# Altium project ESC_Project.PrjPcb
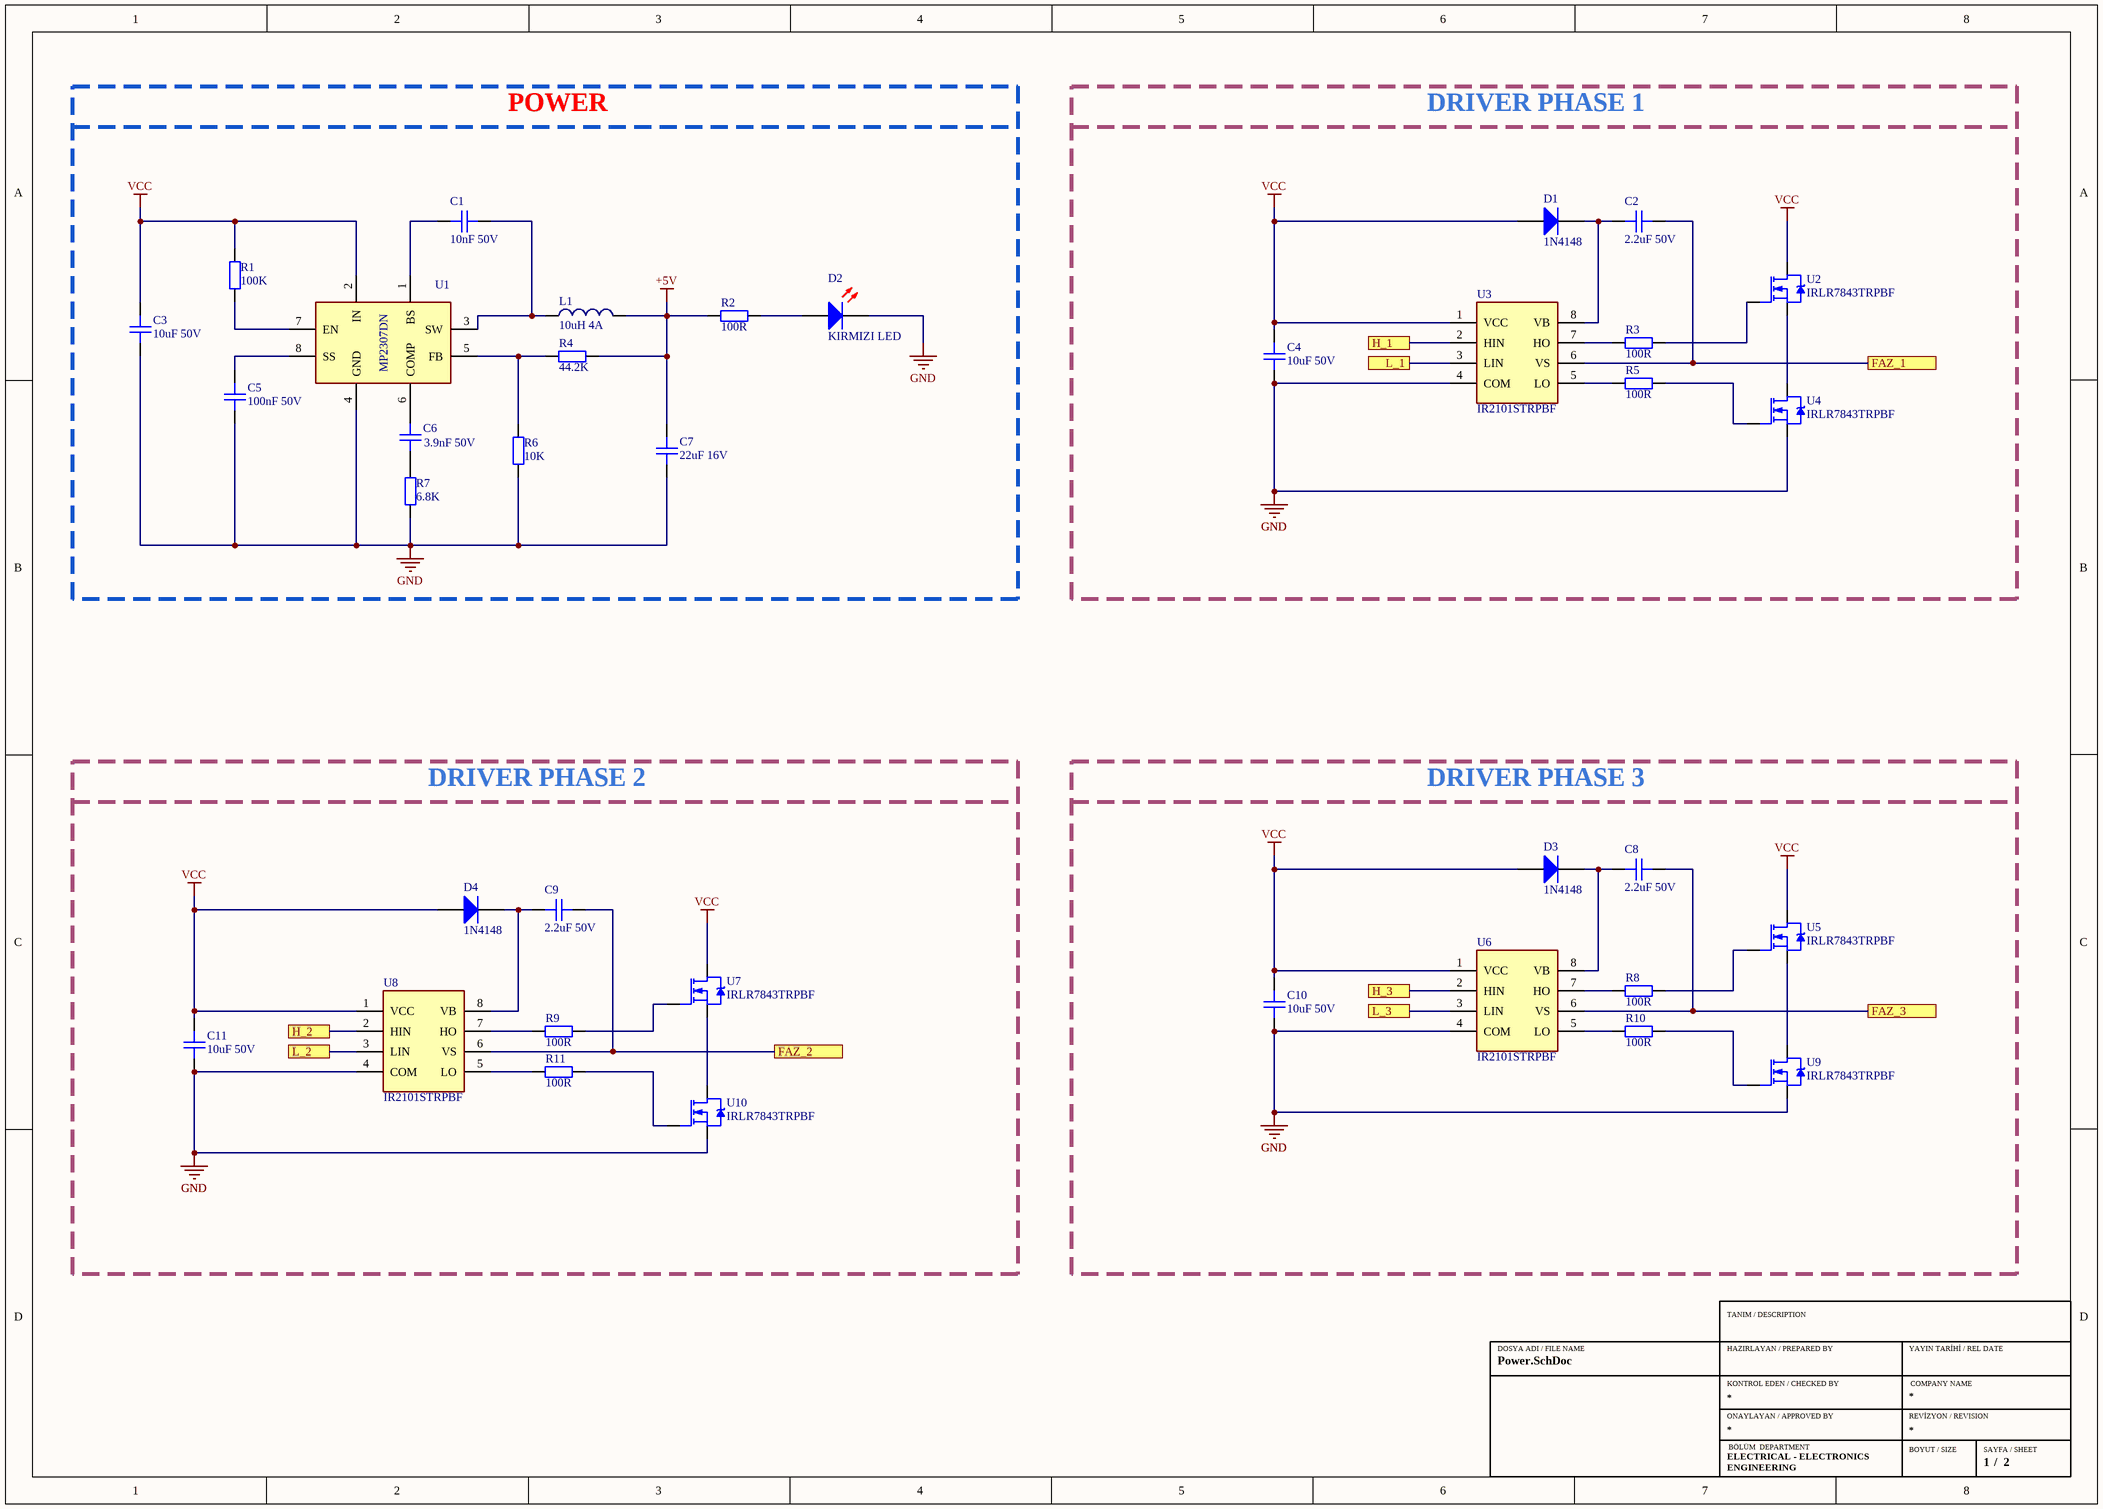
[diagram p0: Power.SchDoc]
2 sheets, 62 parts. Net scope: global (net labels, ports and power ports of the same name join across sheets).
Board file: ESC_PCB.PcbDoc
Sheets:
  Power.SchDoc
  MCU.SchDoc

## Sheet Power.SchDoc
size A3; SheetNumber: 1; SheetTotal: 2

### Parts
C1  Deger: 10nF 50V  [CAP 0805/2012]  (hidden comment: CAP CER 10000PF 50V X7R 0805)
C2  Deger: 2.2uF 50V  [CAP 1206/3216]  (hidden comment: CAP CER 2.2UF 50V X5R 1206)
C3  Deger: 10uF 50V  [CAP 1206/3216]  (hidden comment: CAP CER 10UF 50V X5R 1206)
C4  Deger: 10uF 50V  [CAP 1206/3216]  (hidden comment: CAP CER 10UF 50V X5R 1206)
C5  Deger: 100nF 50V  [CAP 0805/2012]  (hidden comment: CAP CER 0.1UF 50V X7R 0805)
C6  Deger: 3.9nF 50V  [CAP 0805/2012]  (hidden comment: CAP CER 3900PF 50V X7R 0805)
C7  Deger: 22uF 16V  [CAP 1206/3216]  (hidden comment: CAP CERAMIC 22UF 16V X7S 20% PAD)
C8  Deger: 2.2uF 50V  [CAP 1206/3216]  (hidden comment: CAP CER 2.2UF 50V X5R 1206)
C9  Deger: 2.2uF 50V  [CAP 1206/3216]  (hidden comment: CAP CER 2.2UF 50V X5R 1206)
C10  Deger: 10uF 50V  [CAP 1206/3216]  (hidden comment: CAP CER 10UF 50V X5R 1206)
C11  Deger: 10uF 50V  [CAP 1206/3216]  (hidden comment: CAP CER 10UF 50V X5R 1206)
D1  1N4148 Diyot  [SOD-123]  (value not drawn)
D2  Deger: KIRMIZI LED  [SMD: LED 0805/2012 RED]  (hidden comment: Red 645nm LED Indication - Discrete 1.8V 0805)
D3  1N4148 Diyot  [SOD-123]  (value not drawn)
D4  1N4148 Diyot  [SOD-123]  (value not drawn)
L1  FIXED IND 10UH 4A 68 MOHM SMD  [ASPI-0630LR-100M-T15]  (value not drawn)
R1  Deger: 100K  [RES_0805]  (hidden comment: RES SMD 100K OHM 1% 1/8W 0805)
R2  Deger: 100R  [RES_0805]  (hidden comment: RES SMD 100 OHM 1% 1/8W 0805)
R3  Deger: 100R  [RES_0805]  (hidden comment: RES SMD 100 OHM 1% 1/8W 0805)
R4  Deger: 44.2K  [RES_0805]  (hidden comment: RES SMD 44.2K OHM 1% 1/8W 0805)
R5  Deger: 100R  [RES_0805]  (hidden comment: RES SMD 100 OHM 1% 1/8W 0805)
R6  Deger: 10K  [RES_0805]  (hidden comment: RES SMD 10K OHM 1% 1/8W 0805)
R7  Deger: 6.8K  [RES_0805]  (hidden comment: RES SMD 6.8K OHM 1% 1/8W 0805)
R8  Deger: 100R  [RES_0805]  (hidden comment: RES SMD 100 OHM 1% 1/8W 0805)
R9  Deger: 100R  [RES_0805]  (hidden comment: RES SMD 100 OHM 1% 1/8W 0805)
R10  Deger: 100R  [RES_0805]  (hidden comment: RES SMD 100 OHM 1% 1/8W 0805)
R11  Deger: 100R  [RES_0805]  (hidden comment: RES SMD 100 OHM 1% 1/8W 0805)
U1  IC REG BUCK ADJUSTABLE 3A 8SOIC  [SOIC8_PAD]  (value not drawn)
U2  Deger: IRLR7843TRPBF  [DPAK]  (hidden comment: MOSFET N-CH 30V 161A DPAK)
U3  Deger: IR2101STRPBF  [SOIC8]  (hidden comment: IC GATE DRVR HALF-BRIDGE 8SOIC)
U4  Deger: IRLR7843TRPBF  [DPAK]  (hidden comment: MOSFET N-CH 30V 161A DPAK)
U5  Deger: IRLR7843TRPBF  [DPAK]  (hidden comment: MOSFET N-CH 30V 161A DPAK)
U6  Deger: IR2101STRPBF  [SOIC8]  (hidden comment: IC GATE DRVR HALF-BRIDGE 8SOIC)
U7  Deger: IRLR7843TRPBF  [DPAK]  (hidden comment: MOSFET N-CH 30V 161A DPAK)
U8  Deger: IR2101STRPBF  [SOIC8]  (hidden comment: IC GATE DRVR HALF-BRIDGE 8SOIC)
U9  Deger: IRLR7843TRPBF  [DPAK]  (hidden comment: MOSFET N-CH 30V 161A DPAK)
U10  Deger: IRLR7843TRPBF  [DPAK]  (hidden comment: MOSFET N-CH 30V 161A DPAK)

### Ports
FAZ_1, FAZ_2, FAZ_3, H_1, H_2, H_3, L_1, L_2, L_3

### Nets
+5V: C7.2 L1.2 R2.1 R4.2
GND: C3.1 C4.1 C5.1 C7.1 C10.1 C11.1 D2.2(K) R6.1 R7.1 U1.4(GND) U3.4(COM) U4.3(S) U6.4(COM) U8.4(COM) U9.3(S) U10.3(S)
VCC: C3.2 C4.2 C10.2 C11.2 D1.1(A) D3.1(A) D4.1(A) R1.2 U1.2(IN) U2.4(D) U3.1(VCC) U5.4(D) U6.1(VCC) U7.4(D) U8.1(VCC)
NetC1_1: C1.1 U1.1(BS)
NetC1_2: C1.2 L1.1 U1.3(SW)
NetC2_1: C2.1 D1.2(K) U3.8(VB)
NetC2_2: C2.2 U3.6(VS) ; port FAZ_1
NetC5_2: C5.2 U1.8(SS)
NetC6_1: C6.1 R7.2
NetC6_2: C6.2 U1.6(COMP)
NetC8_1: C8.1 D3.2(K) U6.8(VB)
NetC8_2: C8.2 U6.6(VS) ; port FAZ_3
NetC9_1: C9.1 D4.2(K) U8.8(VB)
NetC9_2: C9.2 U8.6(VS) ; port FAZ_2
NetD2_1: D2.1(A) R2.2
NetR1_1: R1.1 U1.7(EN)
NetR3_1: R3.1 U3.7(HO)
NetR3_2: R3.2 U2.1(G)
NetR4_1: R4.1 R6.2 U1.5(FB)
NetR5_1: R5.1 U3.5(LO)
NetR5_2: R5.2 U4.1(G)
NetR8_1: R8.1 U6.7(HO)
NetR8_2: R8.2 U5.1(G)
NetR9_1: R9.1 U8.7(HO)
NetR9_2: R9.2 U7.1(G)
NetR10_1: R10.1 U6.5(LO)
NetR10_2: R10.2 U9.1(G)
NetR11_1: R11.1 U8.5(LO)
NetR11_2: R11.2 U10.1(G)
NetU2_3: U2.3(S) U4.4(D)
NetU3_2: U3.2(HIN) ; port H_1
NetU3_3: U3.3(LIN) ; port L_1
NetU5_3: U5.3(S) U9.4(D)
NetU6_2: U6.2(HIN) ; port H_3
NetU6_3: U6.3(LIN) ; port L_3
NetU7_3: U7.3(S) U10.4(D)
NetU8_2: U8.2(HIN) ; port H_2
NetU8_3: U8.3(LIN) ; port L_2

### Notes on the sheet
- POWER
- DRIVER PHASE 1
- DRIVER PHASE 2
- DRIVER PHASE 3
- TANIM / DESCRIPTION
- DOSYA ADI / FILE NAME
- HAZIRLAYAN / PREPARED BY
- KONTROL EDEN / CHECKED BY
- YAYIN TARİHİ / REL DATE
- COMPANY NAME
- ONAYLAYAN / APPROVED BY
- ELECTRICAL - ELECTRONICS
- BÖLÜM  DEPARTMENT
- BOYUT / SIZE
- REVİZYON / REVISION
- SAYFA / SHEET
- ENGINEERING
- /

### Library data of the parts
C1 = 10nF 50V 0805: 10000pF ±10% 50V Ceramic Capacitor X7R 0805 (2012 Metric); Cins: Kondansator; Uretici Kodu: CL21B103KBANNNC; Kılıf: 0805; -Sicaklik: -55; +Sicaklik: +125; Lehim Yöntemi: SMD; MSL: 1 (Unlimited)
C2 C8 C9 = 2.2uF 50V 1206: 2.2µF ±10% 50V Ceramic Capacitor X5R 1206 (3216 Metric); Cins: Kondansator; Uretici Kodu: CL31A225KBHNNNE; Kılıf: 1206; -Sicaklik: -55; +Sicaklik: +85; Lehim Yöntemi: SMD; MSL: 1 (Unlimited)
C3 C4 C10 C11 = 10uF 50V 1206: 10µF ±10% 50V Ceramic Capacitor X5R 1206 (3216 Metric); Cins: Kondansator; Uretici Kodu: CL31A106KBHNNNE; Kılıf: 1206; -Sicaklik: -55; +Sicaklik: +125; Lehim Yöntemi: SMD; MSL: 1 (Unlimited)
C5 = 100nF 50V 0805: 0.1µF ±10% 50V Ceramic Capacitor X7R 0805 (2012 Metric); Kılıf: 0805; Cins: Kondansator; Uretici Kodu: CL21B104KBCNNNC; -Sicaklik: -55; +Sicaklik: +125; Lehim Yöntemi: SMD; MSL: 1 (Unlimited)
C6 = 3.9nF 50V 0805: 3900pF ±10% 50V Ceramic Capacitor X7R 0805 (2012 Metric); Cins: Kondansator; Uretici Kodu: CL21B392KBANNNC; Kılıf: 0805; -Sicaklik: -55; +Sicaklik: +125; Lehim Yöntemi: SMD; MSL: 1 (Unlimited)
C7 = 22uF 16V 1206: 22µF ±20% 16V Ceramic Capacitor X7S 1206 (3216 Metric); Cins: Kondansator; Uretici Kodu: GRM31CC71C226ME11L; Kılıf: 1206; -Sicaklik: -55; +Sicaklik: +125; Lehim Yöntemi: SMD; MSL: 1 (Unlimited)
D1 D3 D4 = 1N4148: DIODE GEN PURP 100V 150MA SOD123; Uretici Kodu: 1N4148W-TP; -Sicaklik: -65; +Sicaklik: +150; Lehim Yöntemi: SMD; Cins: Diyot; Kılıf: SOD123; MSL: 1 (Unlimited); Deger: 1N4148
D2 = LED_Kırmızı: LED RED DIFFUSED 0805 SMD; Uretici Kodu: LH R974-LP-1; Kılıf: 0805; -Sicaklik: -40; +Sicaklik: +125; Cins: LED; Lehim Yöntemi: SMD; MSL: 1 (Unlimited)
L1 = 10uH 4A: 10µH Shielded Molded Inductor 4A 68mOhm Max Nonstandard; Cins: Bobin; -Sicaklik: -55; +Sicaklik: +125; Uretici Kodu: ASPI-0630LR-100M-T15; Kılıf: Nonstandard; Lehim Yöntemi: SMD; MSL: 1 (Unlimited); Deger: 10uH 4A
R1 = 100K 0805: 100 kOhms ±1% 0.125W, 1/8W Chip Resistor 0805 (2012 Metric) Moisture Resistant Thick Film; Cins: Direnc; Uretici Kodu: RC0805FR-07100KL; Kılıf: 0805; -Sicaklik: -55; +Sicaklik: +155; Lehim Yöntemi: SMD; MSL: 1 (Unlimited)
R2 R3 R5 R8-R11 = 100R 0805: 100 Ohms ±1% 0.125W, 1/8W Chip Resistor 0805 (2012 Metric) Moisture Resistant Thick Film; Cins: Direnc; Uretici Kodu: RC0805FR-07100RL; Kılıf: 0805; -Sicaklik: -55; +Sicaklik: +155; Lehim Yöntemi: SMD; MSL: 1 (Unlimited)
R4 = 44.2K 0805: 44.2 kOhms ±1% 0.125W, 1/8W Chip Resistor 0805 (2012 Metric) Moisture Resistant Thick Film; Cins: Direnc; Uretici Kodu: RC0805FR-0744K2L; Kılıf: 0805; -Sicaklik: -55; +Sicaklik: +155; Lehim Yöntemi: SMD; MSL: 1 (Unlimited)
R6 = 10K 0805: 10 kOhms ±1% 0.125W, 1/8W Chip Resistor 0805 (2012 Metric) Moisture Resistant Thick Film; Cins: Direnc; Kılıf: 0805; Uretici Kodu: RC0805FR-0710KL; -Sicaklik: -55; +Sicaklik: +155; Lehim Yöntemi: SMD; MSL: 1 (Unlimited)
R7 = 6.8K 0805: 6.8 kOhms ±1% 0.125W, 1/8W Chip Resistor 0805 (2012 Metric) Moisture Resistant Thick Film; Cins: Direnc; Kılıf: 0805; Uretici Kodu: RC0805FR-076K8L; -Sicaklik: -55; +Sicaklik: +155; Lehim Yöntemi: SMD; MSL: 1 (Unlimited)
U1 = MP2307DN: Buck Switching Regulator IC Positive Adjustable 0.925V 1 Output 3A 8-SOIC (0.154", 3.90mm Width) Exposed Pad; Uretici Kodu: MP2307DN-LF-Z; -Sicaklik: -40; +Sicaklik: +85; Lehim Yöntemi: SMD; Cins: IC; Kılıf: 8-SOIC; MSL: 2A (4 Weeks); Deger: MP2307DN
U2 U4 U5 U7 U9 U10 = IRLR7843: N-Channel 30V 161A (Tc) 140W (Tc) Surface Mount D-Pak; Kılıf: DPAK(TO-252-3); -Sicaklik: -55; +Sicaklik: +175; Lehim Yöntemi: SMD; Cins: MOSFET; Uretici Kodu: IRLR7843TRPBF; MSL: 1 (Unlimited)
U3 U6 U8 = IR2101: Half-Bridge Gate Driver IC Non-Inverting 8-SOIC; -Sicaklik: -40; +Sicaklik: +150; Lehim Yöntemi: SMD; Cins: IC; Uretici Kodu: IR2101STRPBF; Kılıf: 8-SOIC; MSL: 2A (4 Weeks)

## Sheet MCU.SchDoc
size A3; SheetNumber: 2; SheetTotal: 2
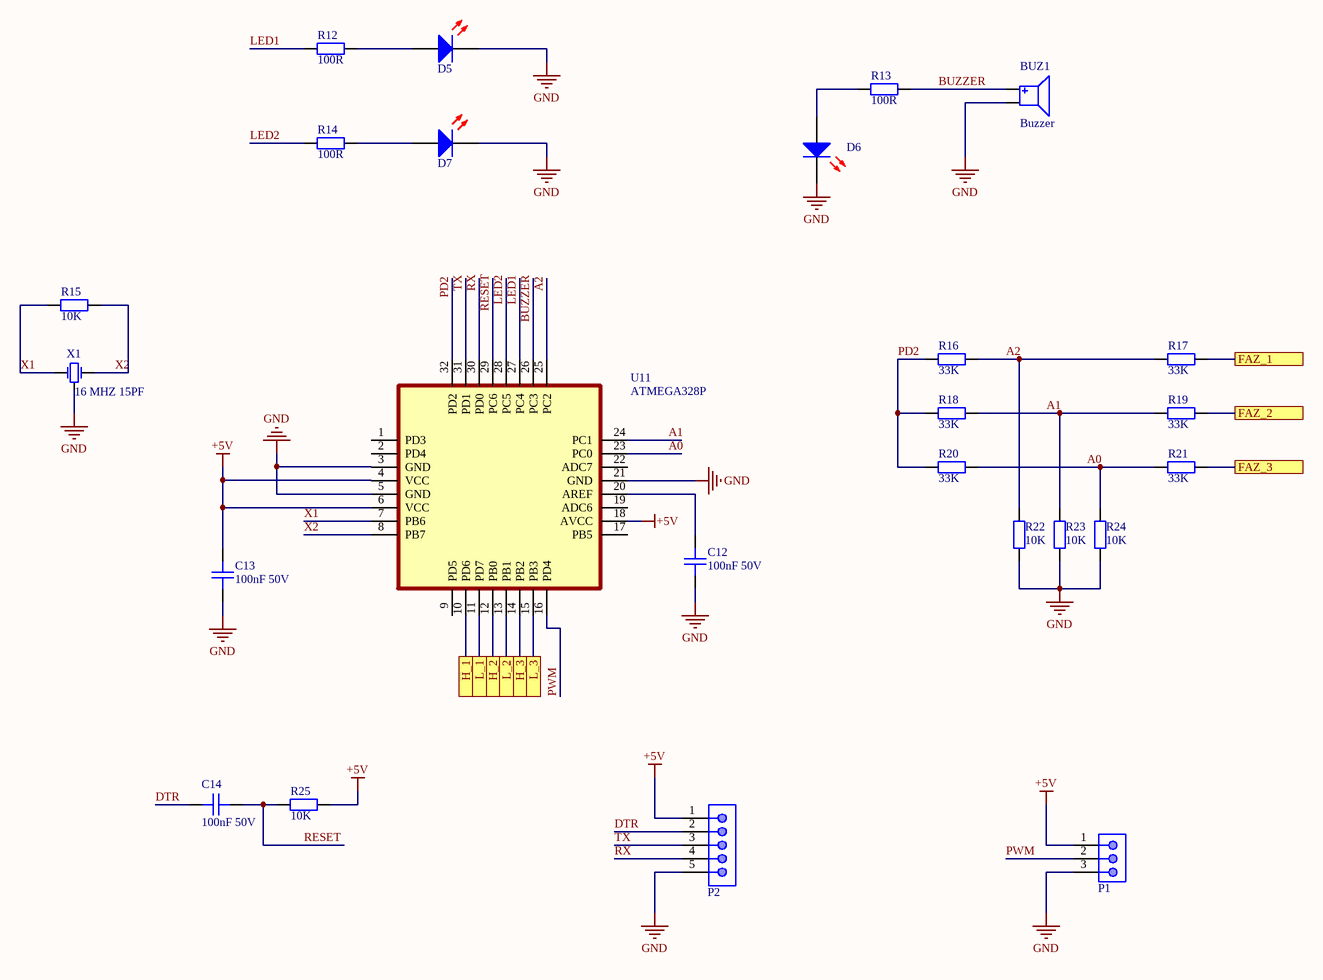
[diagram p1: MCU.SchDoc]

### Parts
BUZ1  Deger: Buzzer  [BUZ: CMT-7525]  (hidden comment: BUZZER MAGN 3.6V 7.5X7.5MM SMD)
C12  Deger: 100nF 50V  [CAP 0805/2012]  (hidden comment: CAP CER 0.1UF 50V X7R 0805)
C13  Deger: 100nF 50V  [CAP 0805/2012]  (hidden comment: CAP CER 0.1UF 50V X7R 0805)
C14  Deger: 100nF 50V  [CAP 0805/2012]  (hidden comment: CAP CER 0.1UF 50V X7R 0805)
D5  Red 645nm LED Indication - Discrete 1.8V 0805  [SMD: LED 0805/2012 RED]  (value not drawn)
D6  Red 645nm LED Indication - Discrete 1.8V 0805  [SMD: LED 0805/2012 RED]  (value not drawn)
D7  Red 645nm LED Indication - Discrete 1.8V 0805  [SMD: LED 0805/2012 RED]  (value not drawn)
P1  WR-PHD 2.54 mm Angled Socket Header  [PWM_CONN]  (value not drawn)
P2  WR-PHD 2.54 mm Angled Socket Header  [TTL_CONN_5]  (value not drawn)
R12  Deger: 100R  [RES_0805]  (hidden comment: RES SMD 100 OHM 1% 1/8W 0805)
R13  Deger: 100R  [RES_0805]  (hidden comment: RES SMD 100 OHM 1% 1/8W 0805)
R14  Deger: 100R  [RES_0805]  (hidden comment: RES SMD 100 OHM 1% 1/8W 0805)
R15  Deger: 10K  [RES_0805]  (hidden comment: RES SMD 10K OHM 1% 1/8W 0805)
R16  Deger: 33K  [RES_0805]  (hidden comment: RES SMD 33K OHM 1% 1/8W 0805)
R17  Deger: 33K  [RES_0805]  (hidden comment: RES SMD 33K OHM 1% 1/8W 0805)
R18  Deger: 33K  [RES_0805]  (hidden comment: RES SMD 33K OHM 1% 1/8W 0805)
R19  Deger: 33K  [RES_0805]  (hidden comment: RES SMD 33K OHM 1% 1/8W 0805)
R20  Deger: 33K  [RES_0805]  (hidden comment: RES SMD 33K OHM 1% 1/8W 0805)
R21  Deger: 33K  [RES_0805]  (hidden comment: RES SMD 33K OHM 1% 1/8W 0805)
R22  Deger: 10K  [RES_0805]  (hidden comment: RES SMD 10K OHM 1% 1/8W 0805)
R23  Deger: 10K  [RES_0805]  (hidden comment: RES SMD 10K OHM 1% 1/8W 0805)
R24  Deger: 10K  [RES_0805]  (hidden comment: RES SMD 10K OHM 1% 1/8W 0805)
R25  Deger: 10K  [RES_0805]  (hidden comment: RES SMD 10K OHM 1% 1/8W 0805)
U11  IC MCU 8BIT 32KB FLASH 32TQFP  [TQFP32]  (value not drawn)
X1  Deger: 16 MHZ 15PF  [CRYSTAL_16MHZ(CTSE16)]  (hidden comment: CERAMIC RES 16.0000MHZ 15PF SMD)

### Ports
FAZ_1, FAZ_2, FAZ_3, H_1, H_2, H_3, L_1, L_2, L_3

### Nets
+5V: C13.2 P1.1 P2.1 R25.2 U11.4(VCC) U11.6(VCC) U11.18(AVCC)
GND: BUZ1.2(Negative) C12.1 C13.1 D5.2(K) D6.2(K) D7.2(K) P1.3 P2.5 R22.1 R23.1 R24.1 U11.3(GND) U11.5(GND) U11.21(GND) X1.2(GND)
A0: R20.2 R21.1 R24.2 U11.23(PC0)
A1: R18.2 R19.1 R23.2 U11.24(PC1)
A2: R16.2 R17.1 R22.2 U11.25(PC2)
BUZZER: BUZ1.1(Positive) R13.2 U11.26(PC3)
DTR: C14.1 P2.2
LED1: R12.1 U11.27(PC4)
LED2: R14.1 U11.28(PC5)
PD2: R16.1 R18.1 R20.1 U11.32(PD2)
PWM: P1.2 U11.16(PD4)
RESET: C14.2 R25.1 U11.29(PC6)
RX: P2.4 U11.30(PD0)
TX: P2.3 U11.31(PD1)
X1: R15.1 U11.7(PB6) X1.1(OSC1)
X2: R15.2 U11.8(PB7) X1.3(OSC2)
NetC2_2: R17.2 ; port FAZ_1
NetC8_2: R21.2 ; port FAZ_3
NetC9_2: R19.2 ; port FAZ_2
NetC12_2: C12.2 U11.20(AREF)
NetD5_1: D5.1(A) R12.2
NetD6_1: D6.1(A) R13.1
NetD7_1: D7.1(A) R14.2
NetU3_2: U11.10(PD6) ; port H_1
NetU3_3: U11.11(PD7) ; port L_1
NetU6_2: U11.14(PB2) ; port H_3
NetU6_3: U11.15(PB3) ; port L_3
NetU8_2: U11.12(PB0) ; port H_2
NetU8_3: U11.13(PB1) ; port L_2

Not connected (* = marked no-connect by the designer): U11 1(PD3) 2(PD4) 9(PD5) 17(PB5) 19(ADC6) 22(ADC7)

### Notes on the sheet
- TANIM / DESCRIPTION
- DOSYA ADI / FILE NAME
- HAZIRLAYAN / PREPARED BY
- KONTROL EDEN / CHECKED BY
- YAYIN TARİHİ / REL DATE
- COMPANY NAME
- ONAYLAYAN / APPROVED BY
- ELECTRICAL - ELECTRONICS
- BÖLÜM  DEPARTMENT
- BOYUT / SIZE
- REVİZYON / REVISION
- SAYFA / SHEET
- ENGINEERING
- /

### Library data of the parts
BUZ1 = Buzzer(CMT-7525-80-SMT-TR): Buzzers Transducer, Externally Driven Magnetic 3.6V 100mA 2.73kHz 80dB @ 3.6V, 10cm Surface Mount Solder Pads; Kılıf: Nonstandard; -Sicaklik: -40; +Sicaklik: +85; Cins: Buzzer; Uretici Kodu: CMT-7525-80-SMT-TR; MSL: 1 (Unlimited); Lehim Yöntemi: SMD
C12-C14 = 100nF 50V 0805: as C5 on sheet Power; MSL: 1 (Unlimited)
D5-D7 = LED_Kırmızı: LED RED DIFFUSED 0805 SMD; Uretici Kodu: LH R974-LP-1; Kılıf: 0805; -Sicaklik: -40; +Sicaklik: +125; Deger: KIRMIZI LED; Cins: LED; Lehim Yöntemi: SMD; MSL: 1 (Unlimited)
P1 = HDR(1X3): Cins: Konnektor; Uretici Kodu: 613003143121; Kılıf: 3POS 2.54MM; -Sicaklik: -40; +Sicaklik: +105; Lehim Yöntemi: MANUEL; MSL: 1 (Unlimited)
P2 = HDR(1X5): Cins: Konnektor; Uretici Kodu: 613005143121; Kılıf: 5POS 2.54MM; -Sicaklik: -40; +Sicaklik: +105; Lehim Yöntemi: MANUEL; MSL: 1 (Unlimited)
R12-R14 = 100R 0805: as R2 on sheet Power; Lehim Yöntemi: SMD; MSL: 1 (Unlimited)
R15 R22-R25 = 10K 0805: as R6 on sheet Power; Lehim Yöntemi: SMD; MSL: 1 (Unlimited)
R16-R21 = 33K 0805: 33 kOhms ±1% 0.125W, 1/8W Chip Resistor 0805 (2012 Metric) Moisture Resistant Thick Film; Cins: Direnc; Kılıf: 0805; -Sicaklik: -55; +Sicaklik: +155; Uretici Kodu: RC0805FR-0733KL; MSL: 1 (Unlimited); Lehim Yöntemi: SMD
U11 = ATMEGA328P: AVR AVR® ATmega Microcontroller IC 8-Bit 20MHz 32KB (16K x 16) FLASH 32-TQFP (7x7); Uretici Kodu: RC0805FR-07100RL; -Sicaklik: -40; +Sicaklik: +85; Lehim Yöntemi: SMD; Cins: IC; Kılıf: 32-TQFP; MSL: 3 (168 Hours); Deger: ATMEGA328P
X1 = CRYSTAL 16.0000MHZ(CSTCE16M0V53-R0): 16MHz Ceramic Resonator Built in Capacitor 15pF ±0.3%  -20°C ~ 80°C Surface Mount; Cins: Kristal; Kılıf: 3-SMD; -Sicaklik: -20; +Sicaklik: +80; Uretici Kodu: CSTCE16M0V53-R0; Lehim Yöntemi: SMD; MSL: 1 (Unlimited)

## Nets that join several sheets
+5V: Power (C7.2 L1.2 R2.1 R4.2), MCU (7 pins)
GND: Power (16 pins), MCU (15 pins)
NetC2_2: Power (C2.2 U3.6), MCU (R17.2)
NetC8_2: Power (C8.2 U6.6), MCU (R21.2)
NetC9_2: Power (C9.2 U8.6), MCU (R19.2)
NetU3_2: Power (U3.2), MCU (U11.10)
NetU3_3: Power (U3.3), MCU (U11.11)
NetU6_2: Power (U6.2), MCU (U11.14)
NetU6_3: Power (U6.3), MCU (U11.15)
NetU8_2: Power (U8.2), MCU (U11.12)
NetU8_3: Power (U8.3), MCU (U11.13)